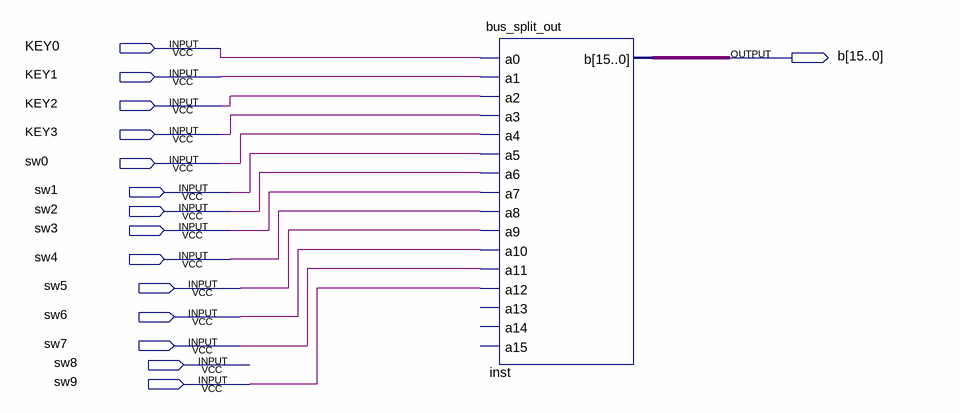
[diagram p0: schematic sheet]
// Quartus schematic input_set.bdf as structural Verilog: 1 symbols, 15 pins
module input_set (
  input  KEY0,
  input  KEY1,
  input  KEY2,
  input  KEY3,
  input  sw0,
  input  sw1,
  input  sw2,
  input  sw3,
  input  sw4,
  input  sw5,
  input  sw6,
  input  sw7,
  input  sw8,
  input  sw9,
  output [15:0] b
);

  bus_split_out inst (
    .a0(KEY0), .a1(KEY1), .a2(KEY2), .a3(KEY3), .a4(sw0), .a5(sw1), .a6(sw2), .a7(sw3), .a8(sw4), .a9(sw5),
    .a10(sw6), .a11(sw7), .a12(sw9), .b(b));  // open: a13, a14, a15
endmodule
